# EAGLE design FordACPAUX (EAGLE 8.2.2)
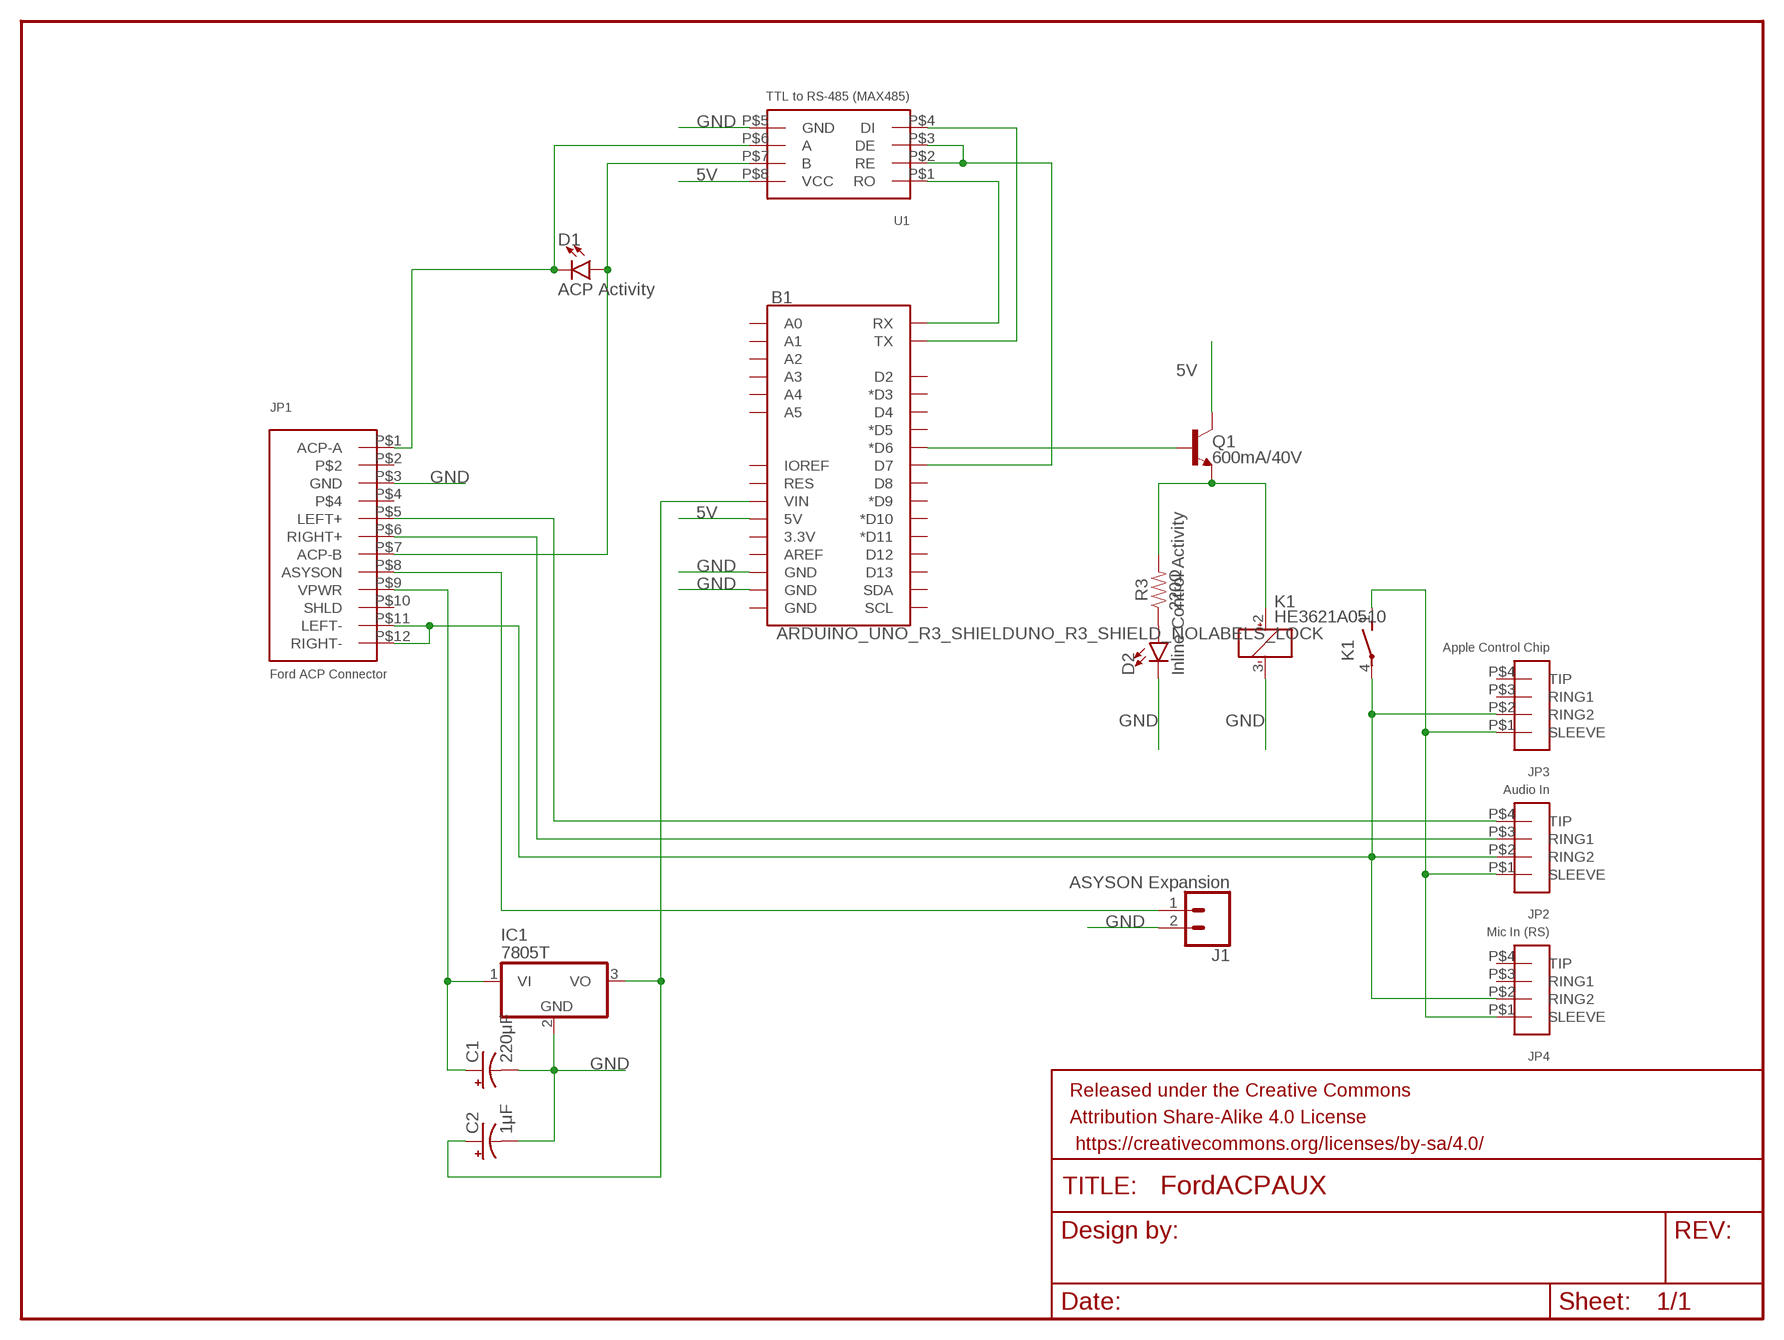
[diagram p0: schematic, sheet 1]

## Parts
B1  ARDUINO_UNO_R3_SHIELDUNO_R3_SHIELD_NOLABELS_LOCK  [UNO_R3_SHIELD_NOLABELS_LOCK]
C1  220μF  CPOL-USE2.5-7  [E2,5-7]
C2  1μF  CPOL-USE2-4  [E2-4]
D1  ACP Activity  LED3MM  [LED_3MM]
D2  Inline Control Activity  LED3MM  [LED_3MM]
FRAME1  FRAME-LETTERNO_PACKAGE  [DUMMY]
IC1  7805T  [TO220H]
J1  ASYSON Expansion  CONN_02LOCK  [1X02_LOCK]
JP1  Ford ACP Connector  AMP-174051-2_040_MULTILOCK  [AMP_174051-2_040_MULTILOCK]
JP2  Audio In  TRRS_JACK4_PIN_PCB_MOUNT  [3-5MM_4_POLE_TRRS_PCB_MOUNT]
JP3  Apple Control Chip  TRRS_JACK4_PIN_PCB_MOUNT  [3-5MM_4_POLE_TRRS_PCB_MOUNT]
JP4  Mic In (RS)  TRRS_JACK4_PIN_PCB_MOUNT  [3-5MM_4_POLE_TRRS_PCB_MOUNT]
K1  HE3621A0510  HE3621  [HE3621]
Q1  600mA/40V  TRANS_NPN-P2N2222A  [TO-92]
R3  220Ω  RESISTORAXIAL-0.3  [AXIAL-0.3]
U1  TTL to RS-485 (MAX485)  MAX485_TTL_TO_RS_485_MODULE  [MAX485_TTL_TO_RS_485_MODULE]

## Nets
5V: B1.5V Q1.1(C) U1.P$8(VCC)
GND: B1.GND@1(GND) B1.GND@2(GND) C1.- C2.- D2.K(C) IC1.2(GND) J1.2 JP1.P$3(GND) K1.3(1:-) U1.P$5(GND)
N$2: D1.A JP1.P$7(ACP-B) U1.P$7(B)
N$4: D1.K(C) JP1.P$1(ACP-A) U1.P$6(A)
N$5: C1.+ IC1.1(VI) JP1.P$9(VPWR)
N$6: B1.D6(*D6) Q1.2(B)
N$7: B1.D7 U1.P$2(RE) U1.P$3(DE)
N$8: K1.2(1:+) Q1.3(E) R3.P$2
N$9: B1.RX U1.P$1(RO)
N$10: B1.TX U1.P$4(DI)
N$11: JP1.P$5(LEFT+) JP2.P$4(TIP)
N$12: JP1.P$6(RIGHT+) JP2.P$3(RING1)
N$13: JP1.P$11(LEFT-) JP1.P$12(RIGHT-) JP2.P$2(RING2) JP3.P$2(RING2) JP4.P$2(RING2) K1.4(2:P)
N$14: JP2.P$1(SLEEVE) JP3.P$1(SLEEVE) JP4.P$1(SLEEVE) K1.1(2:S)
N$15: B1.VIN C2.+ IC1.3(VO)
N$16: D2.A R3.P$1
N$17: J1.1 JP1.P$8(ASYSON)
Unconnected: B1.3.3V B1.A0 B1.A1 B1.A2 B1.A3 B1.A4 B1.A5 B1.AREF B1.D2 B1.D3(*D3) B1.D4 B1.D5(*D5) B1.D8 B1.D9(*D9) B1.D10(*D10) B1.D11(*D11) B1.D12 B1.D13 B1.GND@0(GND) B1.IOREF B1.RES B1.SCL B1.SDA JP1.P$2 JP1.P$4 JP1.P$10(SHLD) JP3.P$3(RING1) JP3.P$4(TIP) JP4.P$3(RING1) JP4.P$4(TIP)

## Library data of the parts
B1 = SparkFun-Boards:ARDUINO_UNO_R3_SHIELD: Arduino R3 Shield Footprint Shield form compatible with the Arduino Uno R3. SparkFun Products: MG2639 Cellular Shield <https://www.sparkfun.com/products/13120> MIDI Shield <https://www.sparkfun.com/products/12898> R3 Stackable Headers Kit <https://www.sparkfun.com/products/11417>
C1 C2 = adafruit:CPOL-US: POLARIZED CAPACITOR, American symbol
D1 D2 = SparkFun-LED:LED: LED (Generic) Standard schematic elements and footprints for 5mm, 3mm, 1206, and 0603 sized LEDs. Generic LEDs with no color specified.; PROD_ID: DIO-08794
FRAME1 = SparkFun-Aesthetics:FRAME-LETTER: Schematic Frame - Letter Standard 8.5x11 US Letter frame; DESIGNER: Nobody; VERSION: v01
IC1 = linear:78*: Positive VOLTAGE REGULATOR Source: http://cache.national.com/ds/LM/LM78L05.pdf http://www.fairchildsemi.com/ds/LM/LM7805.pdf
J1 = SparkFun-Connectors:CONN_02: Multi connection point. Often used as Generic Header-pin footprint for 0.1 inch spaced/style header connections On any of the 0.1 inch spaced packages, you can populate with these: Break Away Headers - Straight <https://www.sparkfun.com/products/116> (PRT-00116) Break Away Male Headers - Right Angle <https://www.sparkfun.com/products/553> (PRT-00553) Female Headers <https://www.sparkfun.com/products/115> (PRT-00115) Break Away Headers - Machine Pin <https://www.sparkfun.com/products/117> (PRT-00117) Break Away Female Headers - Swiss Machine Pin <https://www.sparkfun.com/products/743> (PRT-00743) For SCREWTERMINALS and SPRING TERMINALS visit here: Screw Terimnals on SparkFun.com <https://www.sparkfun.com/search/results?term=Screw+Terminals> (5mm/3.5mm/2.54mm spacing) This device is also useful as a general connection point to wire up your design to another part of your project. Our various solder wires solder well into these plated through hole pads. Hook-Up Wire - Assortment (Stranded, 22 AWG) <https://www.sparkfun.com/products/11375> (PRT-11375) Hook-Up Wire - Assortment (Solid Core, 22 AWG) <https://www.sparkfun.com/products/11367> (PRT-11367) View the entire wire category on our website here <https://www.sparkfun.com/categories/141> Special notes: Molex polarized connector foot print use with: PRT-08233 with associated crimp pins and housings. 2.54_SCREWTERM for use with PRT-10571. 3.5mm Screw Terminal footprints for PRT-08084 5mm Screw Terminal footprints for use with PRT-08432
JP1 = Liu-Ford-ACP-AUX:AMP-174051-2_040_MULTILOCK
JP2-JP4 = Liu-Ford-ACP-AUX:TRRS_JACK: 4 PIN BREAKOUT link (https://www.sparkfun.com/products/11570) 3.5MM 4 POLE TRRS PCB MOUNT link (http://mklec.com/connectors/audio-video-connectors/3.5mm-sockets/3.5mm-4-pole-cellphone-headphone-jack) (http://mklec.com/image/cache/data/connectors/4-pole-3.5mm_jack-dimensions-mklec-350x350.jpg)
K1 = relay:HE3621: RELAY reed, 1 x norm. open, grid 5.08 mm, Hamlin; MF: HAMLIN; MPN: HE3621A2410; OC_FARNELL: 9561943; OC_NEWARK: 50F7993
Q1 = SparkFun-DiscreteSemi:TRANS_NPN: NPN transistor Current controlled devices typically used to amplify current or used as a switch. BC547 - COM-08928 <http://www.sparkfun.com/products/8928> (TO-92 45V 100mA) (1.Collector 2.Base 3.Emitter) 2N3904 - COM-00521 <http://www.sparkfun.com/products/521> (TO-92 40V 200mA) (1.Emitter 2.Base 3.Collector) P2N2222A - COM-12852 <http://www.sparkfun.com/products/12852> (TO-92 40V 600mA) (1.Collector 2.Base 3.Emitter); PROD_ID: TRANS-09536
R3 = SparkFun-Resistors:RESISTOR: Generic Resistor Package
U1 = Liu-Ford-ACP-AUX:MAX485_TTL_TO_RS_485_MODULE

## Board
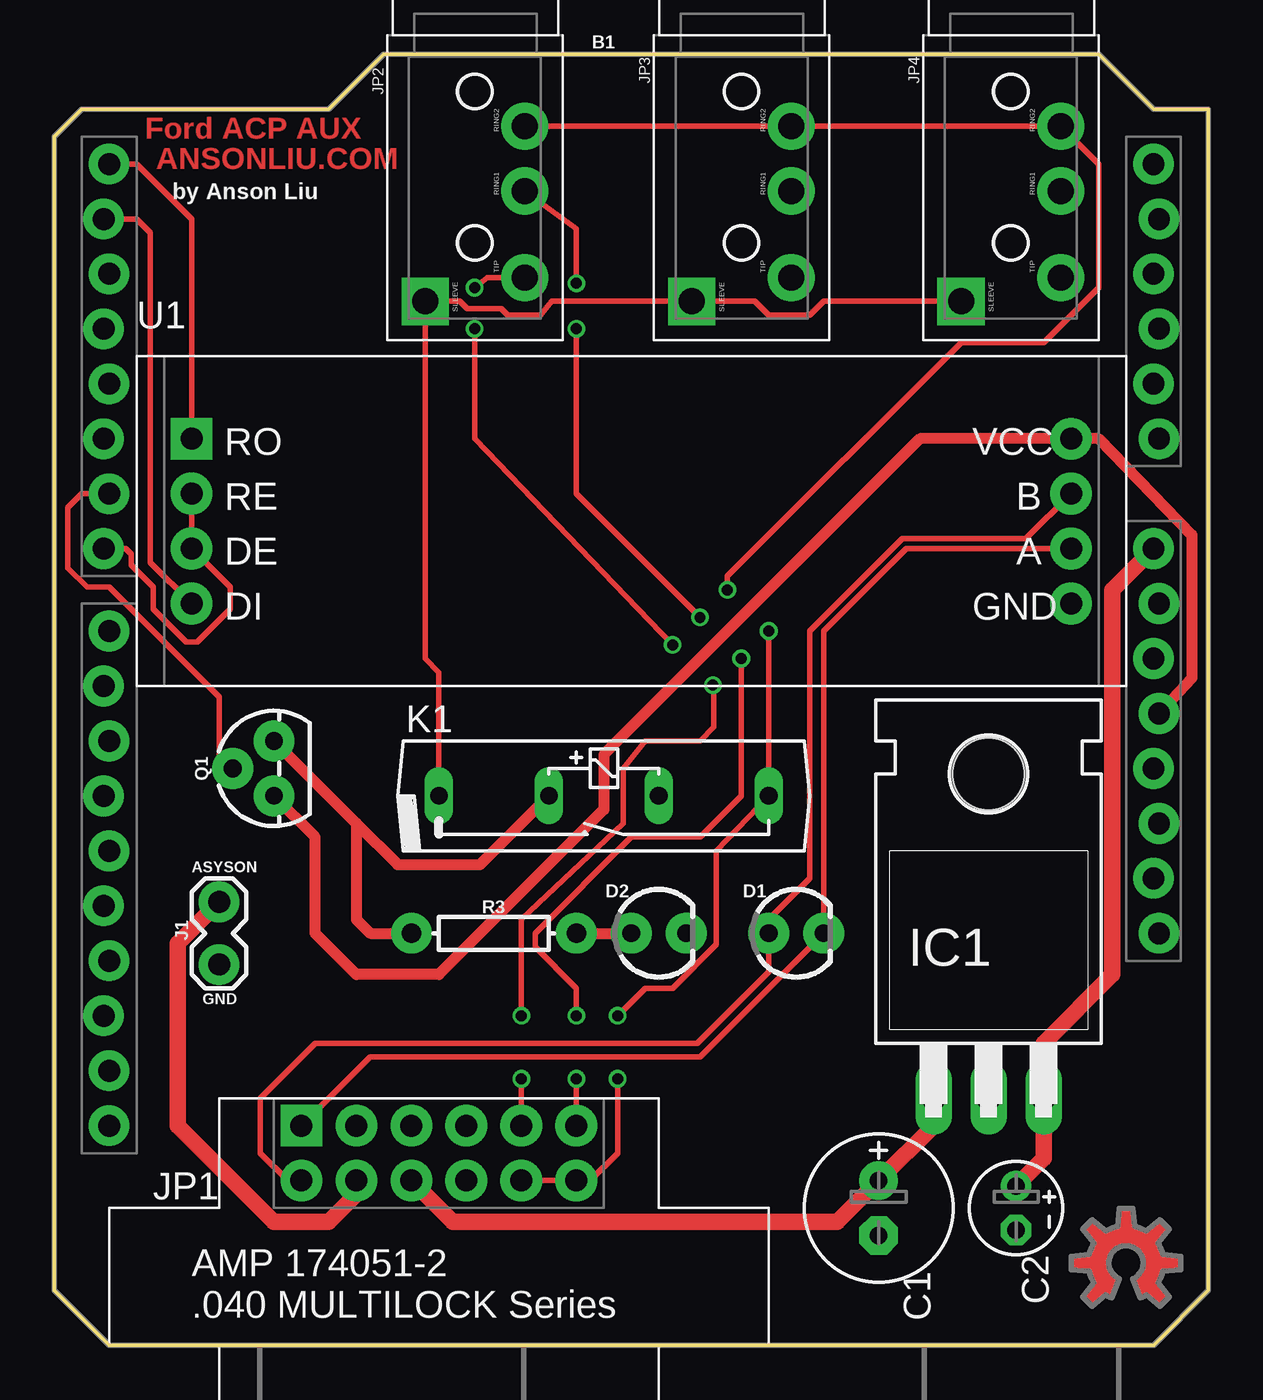
[diagram p1: board, top side]
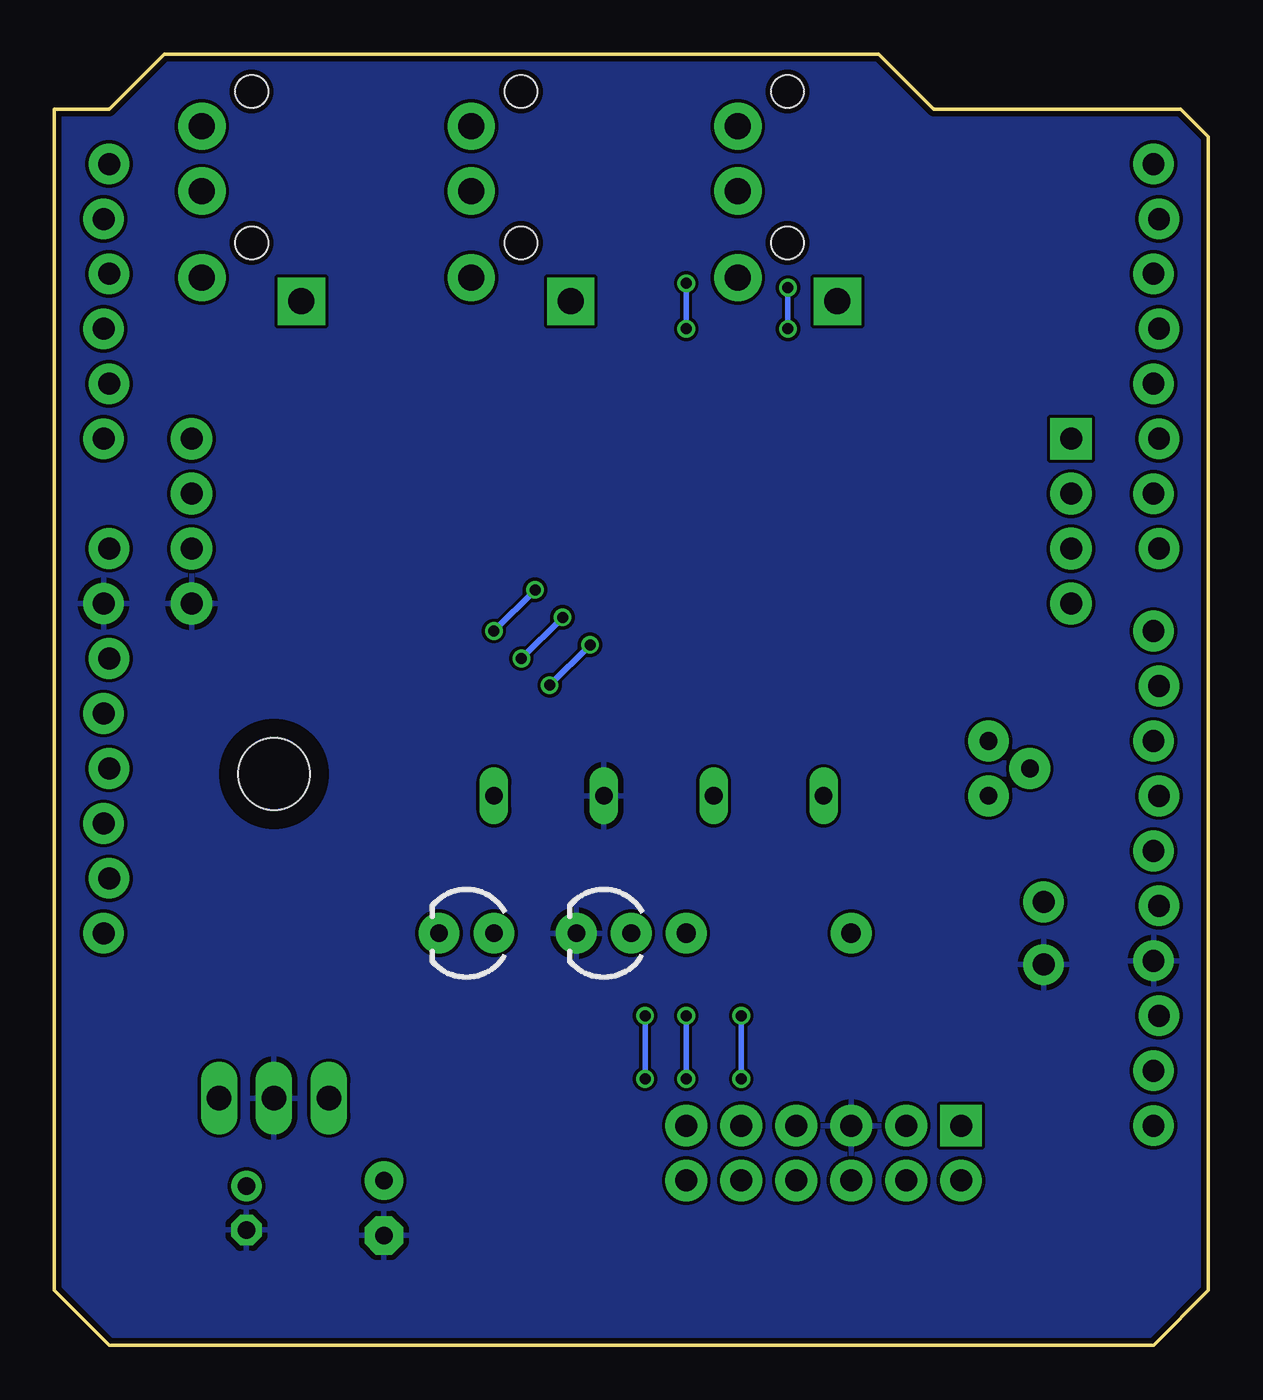
[diagram p2: board, bottom side, seen from below]

Size 53.34 x 59.69 mm. Coordinates in mm from the lower left corner, seen from the top.
Outline: 0,2.54 2.54,0 50.8,0 53.34,2.54 53.34,57.15 50.8,57.15 48.26,59.69 15.24,59.69 12.7,57.15 1.27,57.15 0,55.88 0,2.54
Copper layers (1*16): Top 0.035mm / dielectric 1.5mm / Bottom 0.035mm
Design rules "SeeedStudio_2layer_DRU_no_angle_20140221": minimum track width 6mil, minimum drill 12mil, track to track 6mil, track to pad 6mil, pad to pad 6mil, via to via 6mil, smd to smd 0mil, copper to edge 10mil, drill to drill 10mil, minimum pad ring 10mil, minimum via ring 6mil, stop-mask expansion 2mil, vias tented up to drill 100mil, thermal gap 10mil

### Footprints (pad centres in the part's own frame; a part is rotated, then mirrored left to right if it is on the bottom)
UNO_R3_SHIELD_NOLABELS_LOCK = drill 1.016 pad 1.88: 3.3V 24.13,-3.81; 5V 24.384,-1.27; A0 24.384,11.43; A1 24.13,13.97; A2 24.384,16.51; A3 24.13,19.05; A4 24.384,21.59; A5 24.13,24.13; AREF -24.384,-15.24; D2 -24.13,19.05; D3 -24.384,16.51; D4 -24.13,13.97; D5 -24.384,11.43; D6 -24.13,8.89; D7 -24.384,6.35; D8 -24.13,2.54; D9 -24.384,0; D10 -24.13,-2.54; D11 -24.384,-5.08; D12 -24.13,-7.62; D13 -24.384,-10.16; GND@0 24.13,1.27; GND@1 24.384,3.81; GND@2 -24.13,-12.7; IOREF 24.13,-8.89; NC 24.384,-11.43; RES 24.384,-6.35; RX -24.13,24.13; SCL -24.13,-20.32; SDA -24.13,-17.78; TX -24.384,21.59; VIN 24.13,6.35
E2,5-7 = drill 0.813 pad 1.778: + -1.27,0 | drill 0.813 pad 1.778 octagon: - 1.27,0
E2-4 = drill 0.813 pad 1.422: + -1.016,0 | drill 0.813 pad 1.422 octagon: - 1.016,0
LED_3MM = drill 0.813 pad 1.88: A -1.27,0; K 1.27,0
TO220H = drill 1.118 long: 1 -2.54,-10.16; 2 0,-10.16; 3 2.54,-10.16 | hole 3.302: 0,4.826
1X02_LOCK = drill 1.016 pad 1.88: 1 -0.178,0; 2 2.718,0
AMP_174051-2_040_MULTILOCK = drill 1.016 pad 1.93 square: P$1 1.27,6.35 | drill 1.016 pad 1.93: P$2 1.27,3.81; P$3 1.27,1.27; P$4 1.27,-1.27; P$5 1.27,-3.81; P$6 1.27,-6.35; P$7 -1.27,6.35; P$8 -1.27,3.81; P$9 -1.27,1.27; P$10 -1.27,-1.27; P$11 -1.27,-3.81; P$12 -1.27,-6.35
3-5MM_4_POLE_TRRS_PCB_MOUNT = drill 1.2 pad 2.184 square: P$1 0,0 | drill 1.2 pad 2.184: P$2 -8.1,4.6; P$3 -5.1,4.6; P$4 -1.1,4.6 | hole 1.5: -9.7,2.3; -2.7,2.3
HE3621 = drill 0.813 long: 1 -7.62,0; 2 -2.54,0; 3 2.54,0; 4 7.62,0
TO-92 = drill 0.813 pad 1.88: 1 -1.27,0; 2 0,1.905; 3 1.27,0
AXIAL-0.3 = drill 0.9 pad 1.88: P$1 -3.81,0; P$2 3.81,0
MAX485_TTL_TO_RS_485_MODULE = drill 1.016 pad 1.93 square: P$1 -20.32,3.81 | drill 1.016 pad 1.93: P$2 -20.32,1.27; P$3 -20.32,-1.27; P$4 -20.32,-3.81; P$5 20.32,-3.81; P$6 20.32,-1.27; P$7 20.32,1.27; P$8 20.32,3.81

### Placement (x,y rotation side)
B1  26.67,30.48 0 top
C1  38.1,6.35 270 top
C2  44.45,6.35 270 top
D1  34.29,19.05 0 top
D2  27.94,19.05 0 top
FRAME1  -1.27,-26.67 0 top  (outside the outline)
IC1  43.18,21.59 0 top
J1  7.62,20.32 270 top
JP1  17.78,8.89 90 top
JP2  17.14,48.26 270 top
JP3  29.46,48.26 270 top
JP4  41.91,48.26 270 top
K1  25.4,25.4 0 top
Q1  10.16,26.67 90 top
R3  20.32,19.05 180 top
U1  26.67,38.1 0 top
U$1  [OSHWLOGO_TOP_0.2]  49.53,3.81 0 top

### Tracks (layer width: path | path; a pad name or v marks a point on that pad's centre or on a via)
5V
  Top 0.508: B1.5V 52.58,30.86 52.58,37.47 48.26,41.91 U1.P$8 40.01,41.91 25.4,27.3 25.4,24.77 17.78,17.14 13.97,17.14 12.06,19.05 12.06,23.5 Q1.1
GND
  pour Bottom: 15.24,59.69 12.7,57.15 1.27,57.15 0,55.88 0,2.54 2.54,0 50.8,0 53.34,2.54 53.34,57.15 50.8,57.15 48.26,59.69
N$2
  Top 0.254: JP1.P$7 10.79,7.62 9.53,8.89 9.53,11.43 12.06,13.97 29.72,13.97 33.02,17.27 D1.A 33.02,19.68 34.92,21.59 34.92,33.03 39.18,37.29 44.91,37.29 U1.P$7
N$4
  Top 0.254: U1.P$6 39.37,36.83 35.56,33.02 D1.K 29.84,13.34 14.61,13.34 JP1.P$1
N$5
  Top 0.762: JP1.P$9 18.41,5.71 36.2,5.71 C1.+ 40.64,10.16 IC1.1
N$6
  Top 0.254: B1.D6 1.27,39.37 0.64,38.73 0.64,35.94 1.52,35.05 2.54,35.05 7.62,29.97 7.62,27.3 Q1.2
N$7
  Top 0.254: B1.D7 3.3,36.83 3.56,36.58 3.56,36.07 4.57,35.05 4.57,34.04 6.1,32.51 6.6,32.51 8.13,34.04 8.13,35.05 U1.P$3 U1.P$2
N$8
  Top 0.508: Q1.3 13.97,24.13 | 13.97,24.13 13.97,19.68 14.61,19.05 R3.P$2 | 13.97,24.13 15.88,22.23 19.68,22.23 K1.2
N$9
  Top 0.254: B1.RX 3.81,54.61 6.35,52.07 U1.P$1
N$10
  Top 0.254: B1.TX 3.81,52.07 4.45,51.44 4.45,36.2 U1.P$4
N$11  (via drill 0.51)
  Top 0.254: JP2.P$4 20.03,49.36 v19.43,48.89 | v19.43,46.99 19.43,41.91 v28.57,32.38 | v21.59,15.24 21.59,19.68 26.29,24.13 26.29,26.67 27.3,27.94 29.84,27.94 30.48,28.57 30.48,30.48 v30.44,30.52 | v21.59,12.32 JP1.P$5
  Bottom 0.254: v19.43,48.89 v19.43,46.99 | v28.57,32.38 v30.44,30.52 | v21.59,15.24 v21.59,12.32
N$12  (via drill 0.51)
  Top 0.254: JP1.P$6 v24.13,12.32 | v24.13,15.24 24.13,16.51 22.23,18.41 22.23,19.05 26.67,23.5 29.84,23.5 31.75,25.4 v31.75,31.75 | v29.84,33.66 24.13,39.37 v24.13,46.99 | v24.13,49.1 24.13,51.61 JP2.P$3
  Bottom 0.254: v24.13,12.32 v24.13,15.24 | v31.75,31.75 v29.84,33.66 | v24.13,46.99 v24.13,49.1
N$13  (via drill 0.51)
  Top 0.254: JP1.P$11 JP1.P$12 24.77,7.62 26.04,8.89 v26.04,12.32 | JP2.P$2 JP3.P$2 JP4.P$2 48.26,54.61 48.26,48.9 45.72,46.35 41.91,46.35 31.11,35.56 v31.11,34.92 | v33.02,33.02 K1.4 30.61,22.86 30.61,18.54 28.57,16.51 27.3,16.51 v26.04,15.24
  Bottom 0.254: v33.02,33.02 v31.11,34.92 | v26.04,12.32 v26.04,15.24
N$14
  Top 0.254: K1.1 17.78,31.11 17.14,31.75 JP2.P$1 18.75,48.26 19.08,47.93 20.65,47.93 20.95,47.62 22.48,47.62 22.54,47.68 22.98,48.26 JP3.P$1 32.38,48.26 33.02,47.62 34.92,47.62 35.56,48.26 JP4.P$1
N$15
  Top 0.762: B1.VIN 48.9,34.92 48.9,17.14 45.72,13.97 IC1.3 45.72,8.64 C2.+
N$16
  Top 0.508: R3.P$1 D2.A
N$17
  Top 0.762: JP1.P$8 13.97,6.99 12.7,5.71 10.16,5.71 5.71,10.16 5.71,18.59 J1.1

### Text on the board
Top: Ford ACP AUX | ANSONLIU.COM
tPlace: GND
tNames: by Anson Liu | ASYSON
tStop: Ford ACP AUX | ANSONLIU.COM